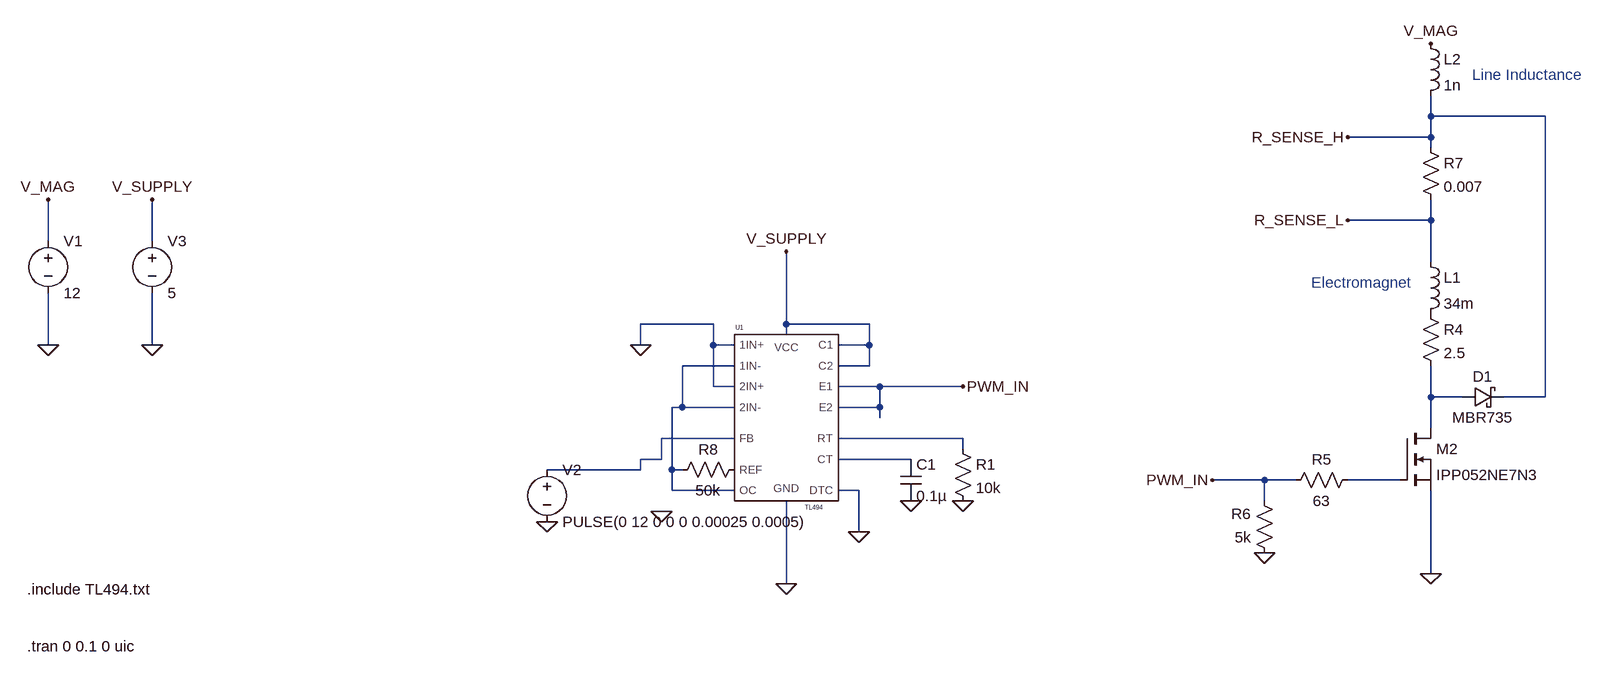
[diagram p0: schematic SwitchedModeController.asc]
SwitchedModeController.asc, the LTspice schematic file:
Version 4
SHEET 1 2264 680
WIRE 1616 -448 1616 -480
WIRE 1792 -448 1616 -448
WIRE 1616 -416 1616 -448
WIRE 1616 -416 1488 -416
WIRE 1616 -400 1616 -416
WIRE 1616 -288 1616 -320
WIRE 1616 -288 1488 -288
WIRE -512 -256 -512 -320
WIRE -352 -256 -352 -320
WIRE 1616 -224 1616 -288
WIRE 512 -128 400 -128
WIRE 624 -128 624 -240
WIRE 752 -128 624 -128
WIRE 624 -112 624 -128
WIRE -512 -96 -512 -176
WIRE -352 -96 -352 -176
WIRE 400 -96 400 -128
WIRE 512 -96 512 -128
WIRE 544 -96 512 -96
WIRE 752 -96 752 -128
WIRE 752 -96 704 -96
WIRE 544 -64 464 -64
WIRE 752 -64 752 -96
WIRE 752 -64 704 -64
WIRE 512 -32 512 -96
WIRE 544 -32 512 -32
WIRE 768 -32 704 -32
WIRE 896 -32 768 -32
WIRE 1616 -16 1616 -64
WIRE 1664 -16 1616 -16
WIRE 1792 -16 1792 -448
WIRE 1792 -16 1728 -16
WIRE 464 0 464 -64
WIRE 464 0 448 0
WIRE 544 0 464 0
WIRE 768 0 768 -32
WIRE 768 0 704 0
WIRE 768 16 768 0
WIRE 1616 32 1616 -16
WIRE 544 48 432 48
WIRE 896 48 704 48
WIRE 896 64 896 48
WIRE 432 80 432 48
WIRE 432 80 400 80
WIRE 816 80 704 80
WIRE 400 96 400 80
WIRE 400 96 256 96
WIRE 448 96 448 0
WIRE 464 96 448 96
WIRE 1360 112 1280 112
WIRE 1408 112 1360 112
WIRE 1568 112 1488 112
WIRE 448 128 448 96
WIRE 544 128 448 128
WIRE 736 128 704 128
WIRE 1360 144 1360 112
WIRE 736 192 736 128
WIRE 1616 256 1616 128
WIRE 624 272 624 144
FLAG -512 -96 0
FLAG 1616 -560 V_MAG
FLAG 1360 224 0
FLAG 1488 -416 R_SENSE_H
FLAG 1488 -288 R_SENSE_L
FLAG -352 -96 0
FLAG 1616 256 0
FLAG -352 -320 V_SUPPLY
FLAG -512 -320 V_MAG
FLAG 624 272 0
FLAG 624 -240 V_SUPPLY
FLAG 816 144 0
FLAG 896 144 0
FLAG 896 -32 PWM_IN
FLAG 1280 112 PWM_IN
FLAG 256 176 0
FLAG 736 192 0
FLAG 432 160 0
FLAG 400 -96 0
SYMBOL voltage -512 -272 R0
WINDOW 123 0 0 Left 0
WINDOW 39 0 0 Left 0
SYMATTR InstName V1
SYMATTR Value 12
SYMBOL nmos 1568 32 R0
SYMATTR InstName M2
SYMATTR Value IPP052NE7N3
SYMBOL res 1600 -160 R0
SYMATTR InstName R4
SYMATTR Value 2.5
SYMBOL ind 1600 -240 R0
SYMATTR InstName L1
SYMATTR Value 34m
SYMBOL schottky 1664 0 R270
WINDOW 0 32 32 VTop 2
WINDOW 3 0 32 VBottom 2
SYMATTR InstName D1
SYMATTR Value MBR735
SYMATTR Description Diode
SYMATTR Type diode
SYMBOL ind 1600 -576 R0
SYMATTR InstName L2
SYMATTR Value 1n
SYMBOL res 1504 96 R90
WINDOW 0 0 56 VBottom 2
WINDOW 3 32 56 VTop 2
SYMATTR InstName R5
SYMATTR Value 63
SYMBOL res 1376 240 R180
WINDOW 0 36 76 Left 2
WINDOW 3 36 40 Left 2
SYMATTR InstName R6
SYMATTR Value 5k
SYMBOL res 1600 -416 R0
SYMATTR InstName R7
SYMATTR Value 0.007
SYMBOL voltage -352 -272 R0
WINDOW 123 0 0 Left 0
WINDOW 39 0 0 Left 0
SYMATTR InstName V3
SYMATTR Value 5
SYMBOL TL494 624 16 R0
SYMATTR InstName U1
SYMBOL cap 800 80 R0
SYMATTR InstName C1
SYMATTR Value 0.1µ
SYMBOL res 880 48 R0
SYMATTR InstName R1
SYMATTR Value 10k
SYMBOL res 560 80 R90
WINDOW 0 0 56 VBottom 2
WINDOW 3 32 56 VTop 2
SYMATTR InstName R8
SYMATTR Value 50k
SYMBOL voltage 256 80 R0
WINDOW 123 0 0 Left 0
WINDOW 39 0 0 Left 0
SYMATTR InstName V2
SYMATTR Value PULSE(0 12 0 0 0 0.00025 0.0005)
TEXT 1680 -512 Left 2 ;Line Inductance
TEXT 1432 -192 Left 2 ;Electromagnet
TEXT -544 368 Left 2 !.tran 0 0.1 0 uic
TEXT -544 280 Left 2 !.include TL494.txt

The netlist it stands for:
* SwitchedModeController.asc
V1 V_MAG 0 12
M2 N002 N006 0 0 IPP052NE7N3
R4 P001 N002 2.5
L1 R_SENSE_L P001 34m
D1 N002 R_SENSE_H MBR735
L2 V_MAG R_SENSE_H 1n
R5 N006 PWM_IN 63
R6 0 PWM_IN 5k
R7 R_SENSE_H R_SENSE_L 0.007
V3 V_SUPPLY 0 5
XU1 0 N001 N003 0 N005 N004 0 V_SUPPLY PWM_IN PWM_IN V_SUPPLY V_SUPPLY N001 P002 N001 0 TL494  ; pins 1IN+ 1IN- FB DTC CT RT GND C1 E1 E2 C2 VCC OC REF 2IN- 2IN+
C1 N005 0 0.1µ
R1 N004 0 10k
R8 P002 N001 50k
V2 N003 0 PULSE(0 12 0 0 0 0.00025 0.0005)
.model D D
.lib standard.dio
.model NMOS NMOS
.model PMOS PMOS
.lib standard.mos
* Line Inductance
* Electromagnet
.tran 0 0.1 0 uic
.include TL494.txt
.lib TL494.txt
.backanno
.end